# Altium project CONN_BOTT.PrjPcb
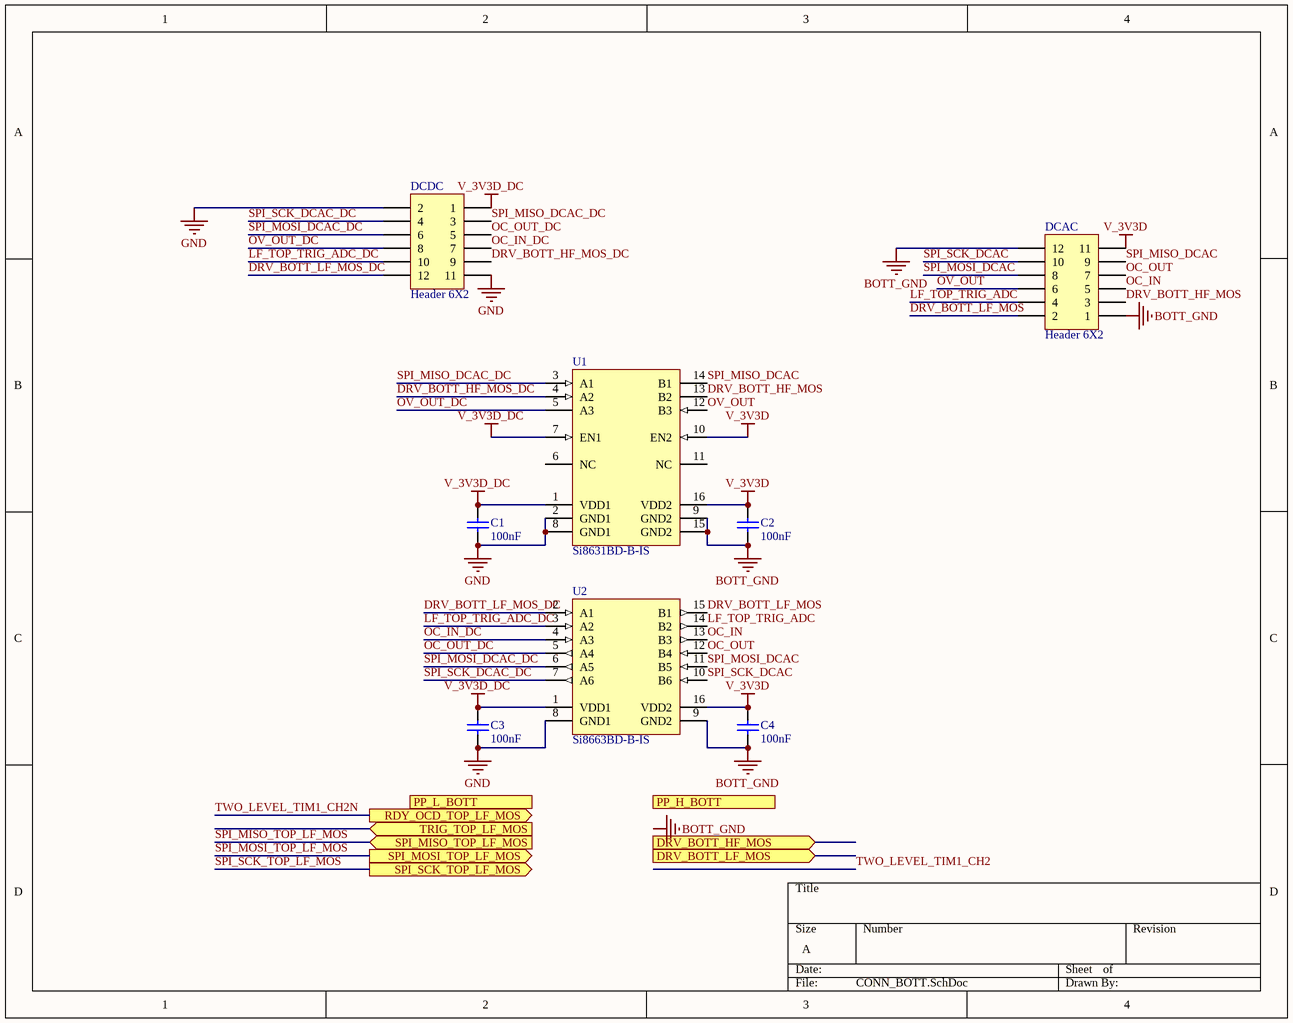
[diagram p0: CONN_BOTT.SchDoc]
1 sheet, 8 parts. Net scope: flat (ports and power ports of the same name join across sheets).
Board file: CONN_BOTT.PcbDoc

## Sheet CONN_BOTT.SchDoc
size A

### Parts
C1  100nF  [SAMS-C0603-2_N]
C2  100nF  [SAMS-C0603-2_N]
C3  100nF  [SAMS-C0603-2_N]
C4  100nF  [SAMS-C0603-2_N]
DCAC  Header 6X2  [EDGE GOLDPIN 12P 1.27mm]
DCDC  Header 6X2  [EDGE GOLDPIN 12P 1.27mm]
U1  Si8631BD-B-IS  [SLAB-SOIC-16-WB_N]
U2  Si8663BD-B-IS  [SLAB-SOIC-16-WB_N]

### Ports
DRV_BOTT_HF_MOS (in), DRV_BOTT_LF_MOS (in), PP_H_BOTT (in), PP_L_BOTT (in), RDY_OCD_TOP_LF_MOS (out), SPI_MISO_TOP_LF_MOS (in), SPI_MOSI_TOP_LF_MOS (out), SPI_SCK_TOP_LF_MOS (out), TRIG_TOP_LF_MOS (in)

### Nets
BOTT_GND: C2.2 C4.2 DCAC.1 DCAC.12 U1.9(GND2) U1.15(GND2) U2.9(GND2)
GND: C1.2 C3.2 DCDC.2 DCDC.11 U1.2(GND1) U1.8(GND1) U2.8(GND1)
V_3V3D: C2.1 C4.1 DCAC.11 U1.10(EN2) U1.16(VDD2) U2.16(VDD2)
V_3V3D_DC: C1.1 C3.1 DCDC.1 U1.1(VDD1) U1.7(EN1) U2.1(VDD1)
DRV_BOTT_HF_MOS: DCAC.3 U1.13(B2)
DRV_BOTT_HF_MOS_DC: DCDC.9 U1.4(A2)
DRV_BOTT_LF_MOS: DCAC.2 U2.15(B1)
DRV_BOTT_LF_MOS_DC: DCDC.12 U2.2(A1)
LF_TOP_TRIG_ADC: DCAC.4 U2.14(B2)
LF_TOP_TRIG_ADC_DC: DCDC.10 U2.3(A2)
OC_IN: DCAC.5 U2.13(B3)
OC_IN_DC: DCDC.7 U2.4(A3)
OC_OUT: DCAC.7 U2.12(B4)
OC_OUT_DC: DCDC.5 U2.5(A4)
OV_OUT: DCAC.6 U1.12(B3)
OV_OUT_DC: DCDC.8 U1.5(A3)
SPI_MISO_DCAC: DCAC.9 U1.14(B1)
SPI_MISO_DCAC_DC: DCDC.3 U1.3(A1)
SPI_MISO_TOP_LF_MOS: port SPI_MISO_TOP_LF_MOS
SPI_MOSI_DCAC: DCAC.8 U2.11(B5)
SPI_MOSI_DCAC_DC: DCDC.6 U2.6(A5)
SPI_MOSI_TOP_LF_MOS: port SPI_MOSI_TOP_LF_MOS
SPI_SCK_DCAC: DCAC.10 U2.10(B6)
SPI_SCK_DCAC_DC: DCDC.4 U2.7(A6)
SPI_SCK_TOP_LF_MOS: port SPI_SCK_TOP_LF_MOS
TWO_LEVEL_TIM1_CH2N: port RDY_OCD_TOP_LF_MOS

Not connected (* = marked no-connect by the designer): U1 6(NC) 11(NC)

### Notes on the sheet
- Labels drawn without touching a wire or pin: BOTT_GND

### Library data of the parts
C1-C4 = CMP-2000-05332-1: Cap Ceramic 0.1uF 50VDC X7R 10% SMD 0603 Paper T/R; Manufacturer: Samsung Electro-Mechanics; Manufacturer Part Number: CL10B104KB8NNNC; Capacitance: 0.1µF; Rated Voltage: 50V; Case Size/Dimension: 0603; Datasheet URL: https://datasheet.ciiva.com/29198/456651-da-01-en-vs-kondensator-0605-29198839.pdf; Manufacturer URL: http://www.samsungsem.com/global/index.jsp; Dielectric: X7R; Tolerance (%): ±10%; Datasheet Version: Nov-10; Supplier 1: Digi-Key; Supplier Part Number 1: 1276-1000-1-ND; RoHS: Yes; Category: Ceramic Capacitors; Stock 1: 13409690; Pricing 1: 1=0.10000, 10=0.03000, 50=0.01620, 100=0.01330, 500=0.00950, 1000=0.00746 (USD); Mount: Surface Mount; Case/Package: 0603; Case Code (Metric): 1608; Case Code (Imperial): 0603; Contact Plating: Tin; Material: Ceramic; Min Operating Temperature: -55°C; Max Operating Temperature: 125°C; Voltage Rating: 50V; Package Quantity: 1; Packaging: Tape and Reel; Tolerance: 10%; Voltage Rating (DC): 50V; Voltage: 50V; Series: CL; Construction: Flat; Length: 1.6mm; Width: 0.031inch; Height: 0.8mm; Depth: 0.8mm; Thickness: 0.035inch; Radiation Hardening: No; Lead Free: Lead Free; RoHS Compliant: Yes; ComponentLink1URL: https://datasheet.ciiva.com/25803/cl10b104kb8nnnc-25803393.pdf?src-supplier=Digi-Key; ComponentLink1Description: https://datasheet.ciiva.com/25803/cl10b104kb8nnnc-25803393.pdf?src-supplier=Digi-Key; ComponentLink2URL: https://datasheet.ciiva.com/26838/getdatasheetpartid-89097-26838411.pdf?src-supplier=Verical; ComponentLink2Description: https://datasheet.ciiva.com/26838/getdatasheetpartid-89097-26838411.pdf?src-supplier=Verical; ComponentLink3URL: https://datasheet.ciiva.com/29198/456651-da-01-en-vs-kondensator-0605-29198839.pdf?src-supplier=Conrad; ComponentLink3Description: https://datasheet.ciiva.com/29198/456651-da-01-en-vs-kondensator-0605-29198839.pdf?src-supplier=Conrad
DCAC DCDC = Header 6X2: Header, 6-Pin, Dual row; LatestRevisionDate: 17-Jul-2002; LatestRevisionNote: Re-released for DXP Platform.; Publisher: Altium Limited
U1 = CMP-0512-00313-1: Low-Power Triple-Channel Digital Isolator, 150 Mbps, 5 kVRMS Isolation Rating, -40 to 125 degC, 16-pin SOIC; Manufacturer: Silicon Labs; Isolation Rating (kV): 5; Maximum Data Rate (Mbps): 150; AEC-Q100: TRUE; Sub-Family: Isolators; Maximum Propagation Delay (ns): 13; 10kV surge: FALSE; Channel Type: Unidirectional; Mounting Technology: Surface Mount; ComponentLink3Description: Package Specification; Code_JEDEC: MS-013; ComponentLink2Description: Datasheet; PartNumber: Si8631BD-B-IS; DatasheetVersion: Rev. 1.3; ComponentLink1URL: http://www.silabs.com/; PackageDescription: 16-Pin Wide Body Plastic Small Outline, Body 10.3 x 7.5 mm, Pitch 1.27 mm; PackageReference: SOIC-16-WB; ComponentLink2URL: http://www.silabs.com/Support%20Documents/TechnicalDocs/Si863x.pdf; ComponentLink1Description: Manufacturer URL; Enable Control: TRUE; ComponentLink3URL: https://www.silabs.com/Support%20Documents/TechnicalDocs/Si823x.pdf
U2 = CMP-0512-00250-1: Low Power Six-Channel Digital Isolator, 150 Mbps, 5 kVRMS Isolation Rating, -40 to 125 degC, 16-pin SOIC; Manufacturer: Silicon Labs; Maximum Data Rate (Mbps): 150; Channel Type: Unidirectional; Maximum Propagation Delay (ns): 13; Sub-Family: Isolators; AEC-Q100: FALSE; Isolation Rating (kV): 5; ComponentLink3Description: Package Specification; PartNumber: Si8663BD-B-IS; PackageDescription: 16-Pin Wide Body Plastic Small Outline, Body 10.3 x 7.5 mm, Pitch 1.27 mm; PackageReference: SOIC-16-WB; DatasheetVersion: Rev. 1.4; Mounting Technology: Surface Mount; Code_JEDEC: MS-013; ComponentLink2Description: Datasheet; Enable Control: FALSE; ComponentLink3URL: https://www.silabs.com/Support%20Documents/TechnicalDocs/Si823x.pdf; ComponentLink1URL: http://www.silabs.com/; ComponentLink1Description: Manufacturer URL; ComponentLink2URL: http://www.silabs.com/Support%20Documents/TechnicalDocs/Si866x.pdf; 10kV surge: FALSE